# Altium schematic sheet SD.SchDoc
size A4; SheetNumber: 8; SheetTotal: 17
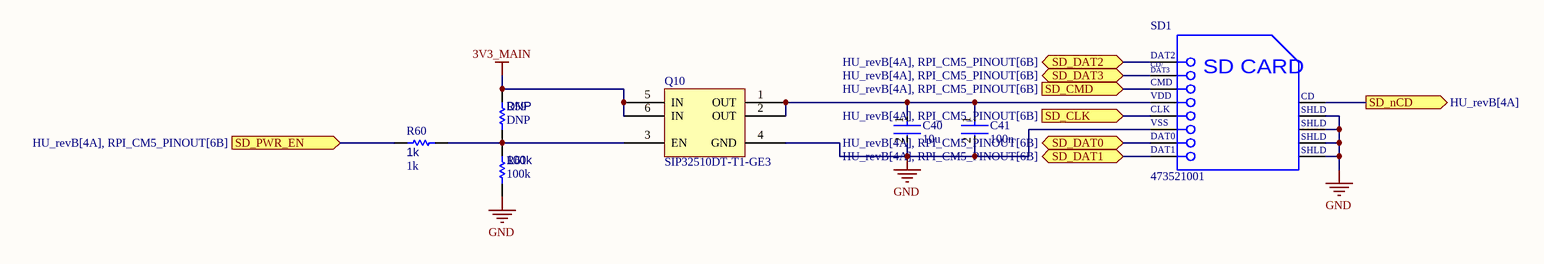
[diagram p0: SD.SchDoc]

## Parts
C40  10u  [FP-0402-L_1_0_0_05-W_0_5-IPC_A]
C41  100n  [FP-0402-L_1_0_0_05-W_0_5-IPC_A]
Q10  SIP32510DT-T1-GE3  [SOT95P284X110-6N]
R59  DNP  [R0603B]
R60  1k  [R0603B]
R61  100k  [R0603B]
SD1  473521001  [MOLX-473521001_V]

## Ports
SD_CLK (in, see HU_revB[4A], RPI_CM5_PINOUT[6B]), SD_CMD (in, see HU_revB[4A], RPI_CM5_PINOUT[6B]), SD_DAT0 (bidir, see HU_revB[4A], RPI_CM5_PINOUT[6B]), SD_DAT1 (bidir, see HU_revB[4A], RPI_CM5_PINOUT[6B]), SD_DAT2 (bidir, see HU_revB[4A], RPI_CM5_PINOUT[6B]), SD_DAT3 (bidir, see HU_revB[4A], RPI_CM5_PINOUT[6B]), SD_nCD (out, see HU_revB[4A]), SD_PWR_EN (in, see HU_revB[4A], RPI_CM5_PINOUT[6B])

## Nets
3V3_MAIN: Q10.5(IN) Q10.6(IN) R59.2
GND: C40.2 C41.2 Q10.4(GND) R61.1 SD1.6(VSS) SD1.10(SHLD) SD1.11(SHLD) SD1.12(SHLD) SD1.13(SHLD)
SD_CLK: SD1.5(CLK) ; port SD_CLK
SD_CMD: SD1.3(CMD) ; port SD_CMD
SD_DAT0: SD1.7(DAT0) ; port SD_DAT0
SD_DAT1: SD1.8(DAT1) ; port SD_DAT1
SD_DAT2: SD1.1(DAT2) ; port SD_DAT2
SD_DAT3: SD1.2(CD/DAT3) ; port SD_DAT3
SD_nCD: SD1.9(CD) ; port SD_nCD
SD_PWR_EN: R60.2 ; port SD_PWR_EN
NetC40_1: C40.1 C41.1 Q10.1(OUT) Q10.2(OUT) SD1.4(VDD)
NetQ10_3: Q10.3(EN) R59.1 R60.1 R61.2

## Notes on the sheet
- (in symbol CMP-2000-05848-1) CD/; DAT3; SD CARD

## Library data of the parts
C40 C41 = CMP-001-00058-1: LARGE PADS, 0402 CAP, CHANGE COMMENT TO MATCH REAL P/N; Capacitor Type: Ceramic; Min Operating Temperature: -55°C; Mounting Technology: Surface Mount; Pins: 2; Case/Package: 0402; RoHS Compliant: Yes; Max Operating Temperature: 85°C
Q10 = CMP-019-00054-1: Power Switch ICs – Power Distribution; VISHAY; SIP32510DT-T1-GE3; 1; 1; 5.5 V; SOT-23-6; Max Supply Voltage: 5.5V; Max Power Dissipation: 833mW; Min Supply Voltage: 1.2V; Case/Package: SOT-23-6; Mounting Technology: Surface Mount; Max Operating Temperature: 85°C; Min Operating Temperature: -40°C
R59-R61 = CMP-009-00002-14: Resistor
  R59: Value: DNP
  R60: Value: 1k
  R61: Value: 100k
SD1 = CMP-2000-05848-1: MicroSD(TM), Pitch 1.1 mm, 8 Position, Height 1.88 mm, -20 to 85 degC, RoHS, Tape and Reel; Manufacturer: Molex; Datasheet Version: Rev. G, 01/2012; Datasheet URL: http://www.molex.com/pdm_docs/sd/473521001_sd.pdf; Package Reference: 473521001; Manufacturer URL: http://www.molex.com/; Mounting Technology: SurfaceMount; Package Description: MicroSD(TM), Pitch 1.1 mm, 8 Position, Height 1.88 mm